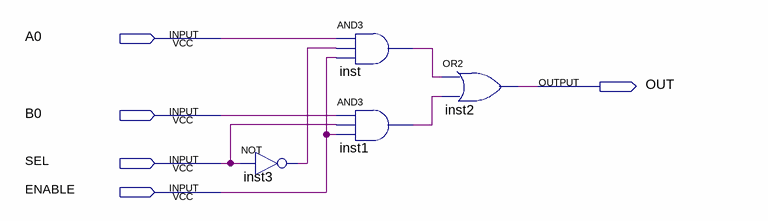
[diagram p0: schematic sheet]
// Quartus schematic mux_2to1.bdf as structural Verilog: 4 symbols, 5 pins
module mux_2to1 (
  input  A0,
  input  B0,
  input  SEL,
  input  ENABLE,
  output OUT
);

  wire inst1_out, inst3_out, inst_out;

  not inst3 (inst3_out, SEL);
  and inst (inst_out, A0, inst3_out, ENABLE);
  and inst1 (inst1_out, B0, SEL, ENABLE);
  or inst2 (OUT, inst_out, inst1_out);
endmodule
